# EAGLE design BPW5044-MIDIAUD-Wing (EAGLE 5.11)
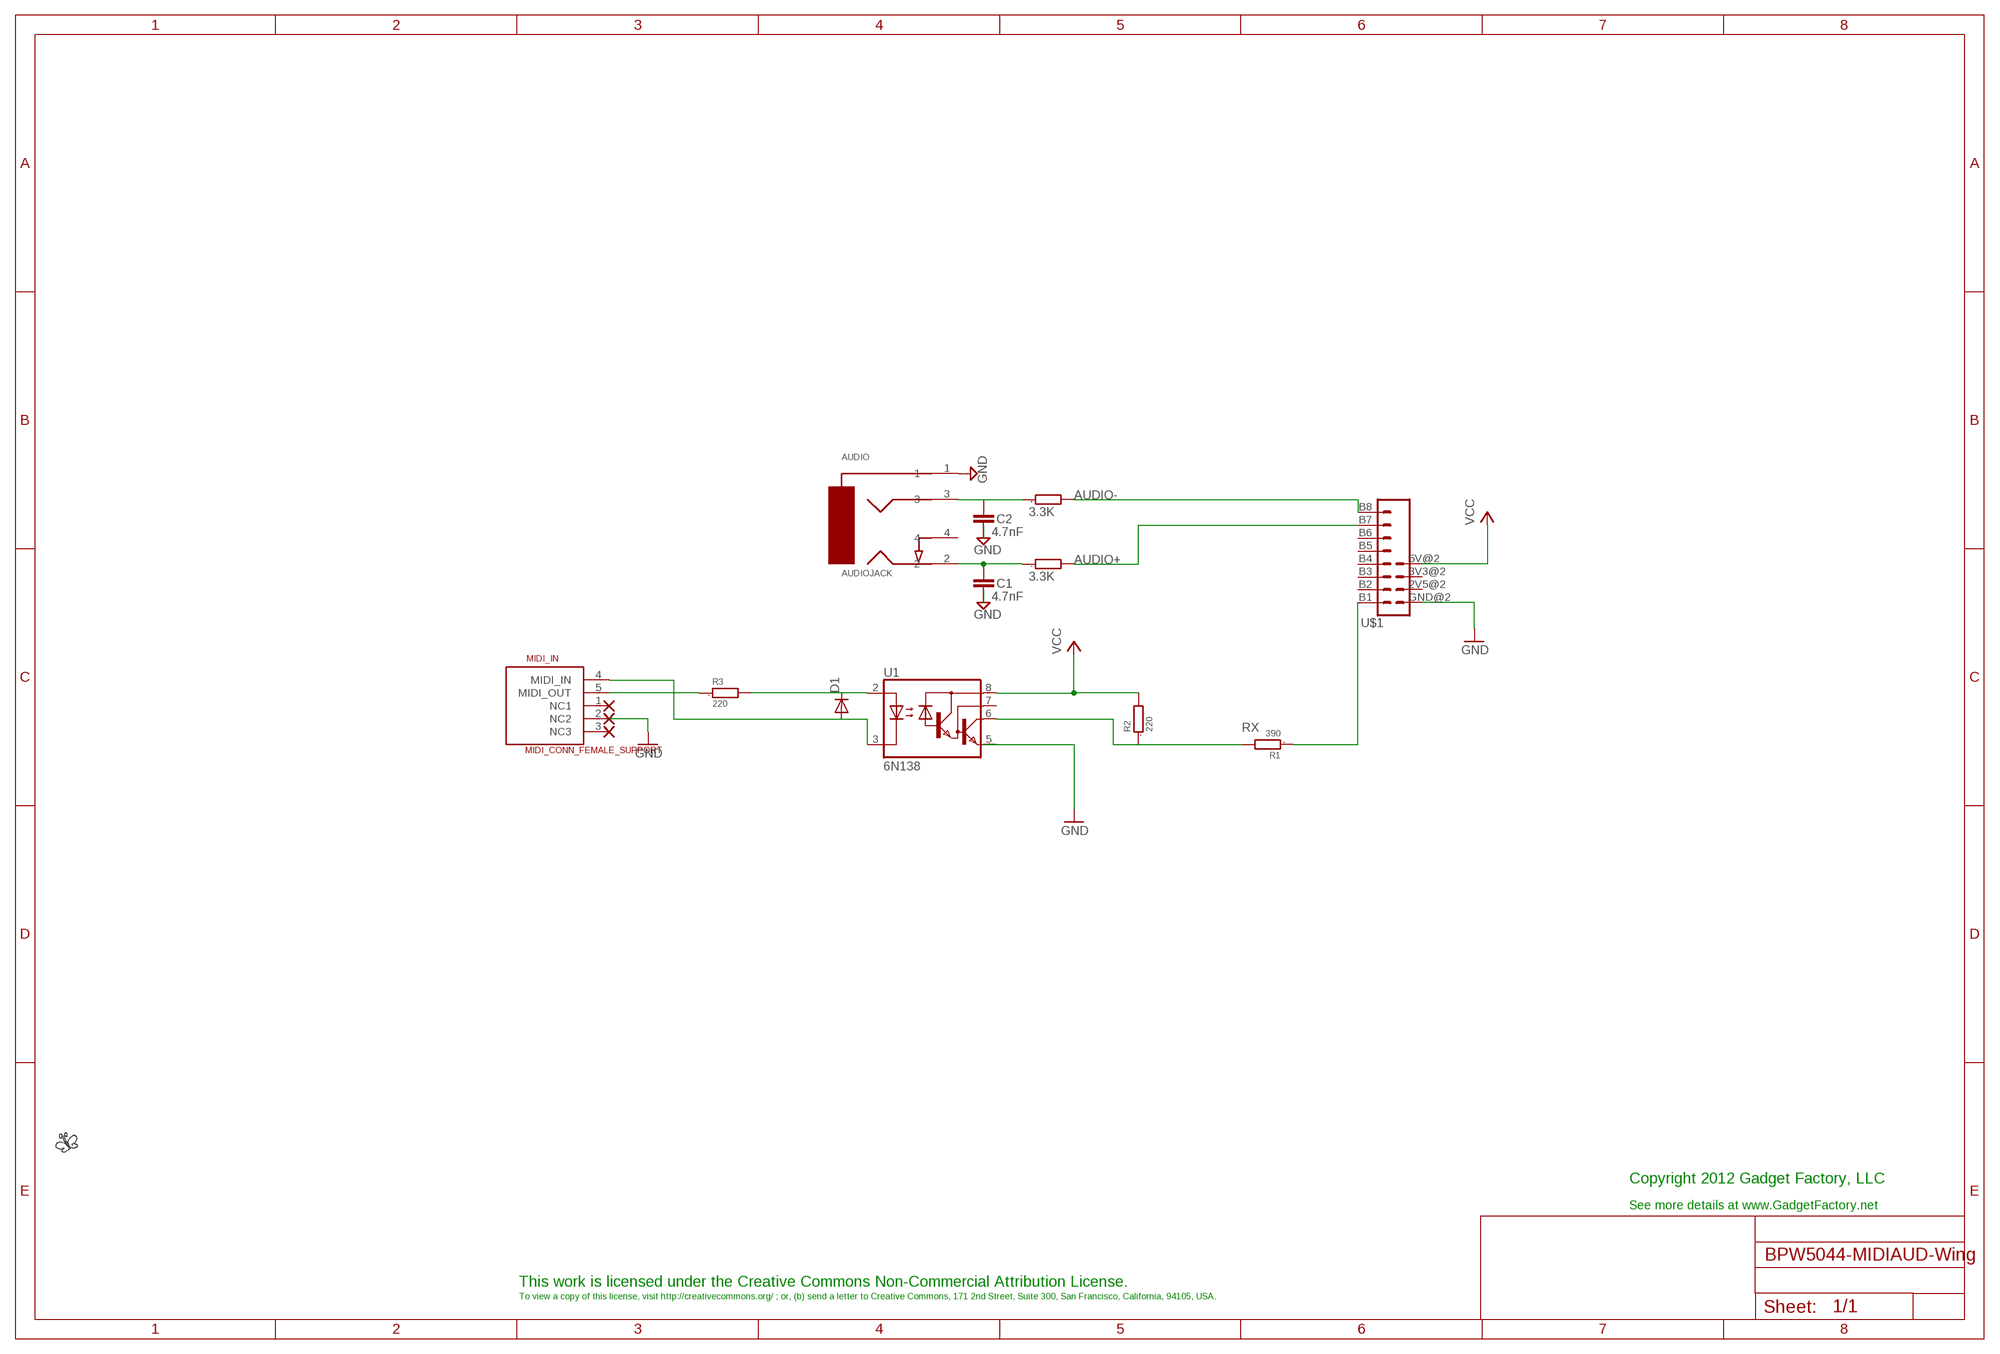
[diagram p0: schematic, sheet 1]

## Parts
AUDIO  AUDIOJACK  [AUDJCK]
C1  4.7nF  C-EU050-025X075  [C050-025X075]
C2  4.7nF  C-EU050-025X075  [C050-025X075]
D1  DIODE1N4148  [DIODE-1N4148]
LOGO1  BUTTERFLY_LOGO  [BUTTERFLY_LOGO]
MIDI_IN  MIDI_CONN_FEMALE_SUPPORT  [DIN_5_FEMALE_SUPPORT]
R1  390  R  [DUALRESISTOR]
R2  220  R  [DUALRESISTOR]
R3  220  R  [DUALRESISTOR]
R4  3.3K  R  [DUALRESISTOR]
R5  3.3K  R  [DUALRESISTOR]
U1  6N138  [DIL08]
U$1  WING_8BIT  [WINGSIDE_8BIT]

## Nets
AUDIO+: R4.2 U$1.B7
AUDIO-: R5.2 U$1.B8
GND: AUDIO.1 C1.2 C2.2 MIDI_IN.2(NC2) U1.5(GND) U$1.GND@2(GND)
N$1: AUDIO.3 C2.1 R5.1
N$2: D1.A MIDI_IN.4(MIDI_IN) U1.3(C)
N$3: D1.C R3.2 U1.2(A)
N$4: MIDI_IN.5(MIDI_OUT) R3.1
N$5: AUDIO.2 C1.1 R4.1
N$6: R1.1 U$1.B1
RX: R1.2 R2.1 U1.6(VO)
VCC: R2.2 U1.8(VCC) U$1.5V@2(5V)
Unconnected: AUDIO.4 MIDI_IN.1(NC1) MIDI_IN.3(NC3) U1.7(VB) U$1.2V5@2(2V5) U$1.3V3@2(3V3) U$1.B2 U$1.B3 U$1.B4 U$1.B5 U$1.B6

## Notes on the sheet
- Copyright 2012 Gadget Factory, LLC
- See more details at www.GadgetFactory.net
- This work is licensed under the Creative Commons Non-Commercial Attribution License.
- To view a copy of this license, visit http://creativecommons.org/ ; or, (b) send a letter to Creative Commons, 171 2nd Street, Suite 300, San Francisco, California, 94105, USA.

## Library data of the parts
AUDIO = GadgetFactory:AUDIOJACK
C1 C2 = resistor:C-EU: CAPACITOR, European symbol
D1 = SparkFun:DIODE: Diode These are standard reverse protection diodes and small signal diodes. SMA package can handle up to about 1A. SOD-323 can handle about 200mA. What the SOD-323 package when ordering, there are some mfgs out there that are 5-pin packages.
LOGO1 = GadgetFactory_Pub:BUTTERFLY_LOGO
MIDI_IN = GadgetFactory:MIDI_CONN_FEMALE_SUPPORT
R1-R5 = GadgetFactory:R: RESISTOR, European symbol
U1 = optocoupler:6N138: MOTOROLA OPTO COUPLER; MF: VISHAY/TELEFUNKEN; MPN: 6N138; OC_FARNELL: 9860150; OC_NEWARK: 35K5294
U$1 = GadgetFactory_Pub:WING_8BIT

## Board
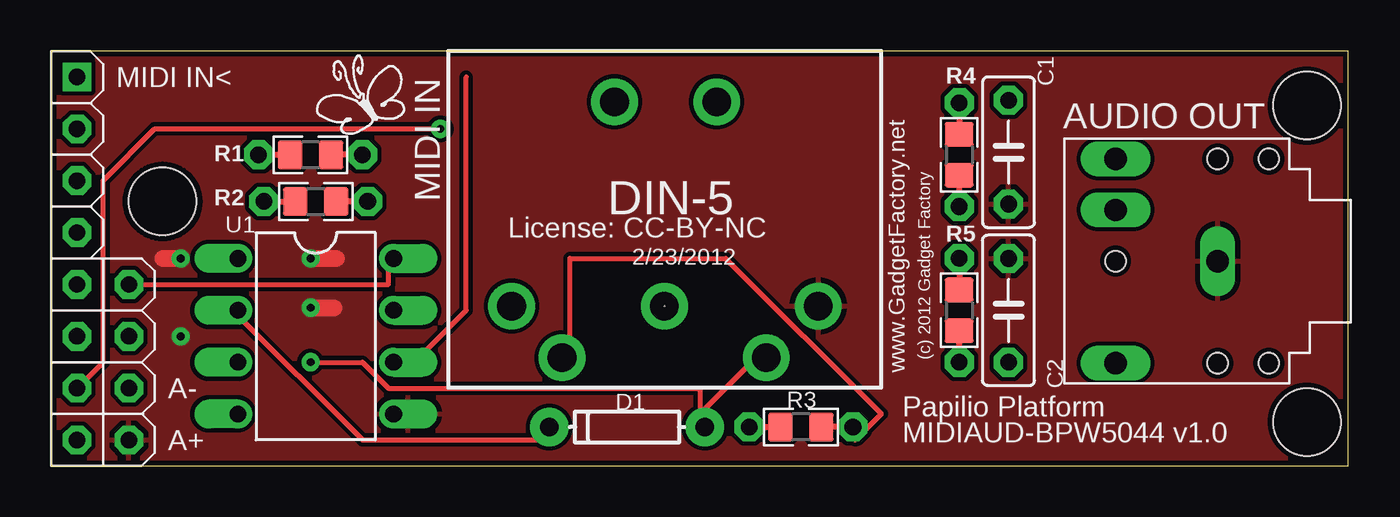
[diagram p1: board, top side]
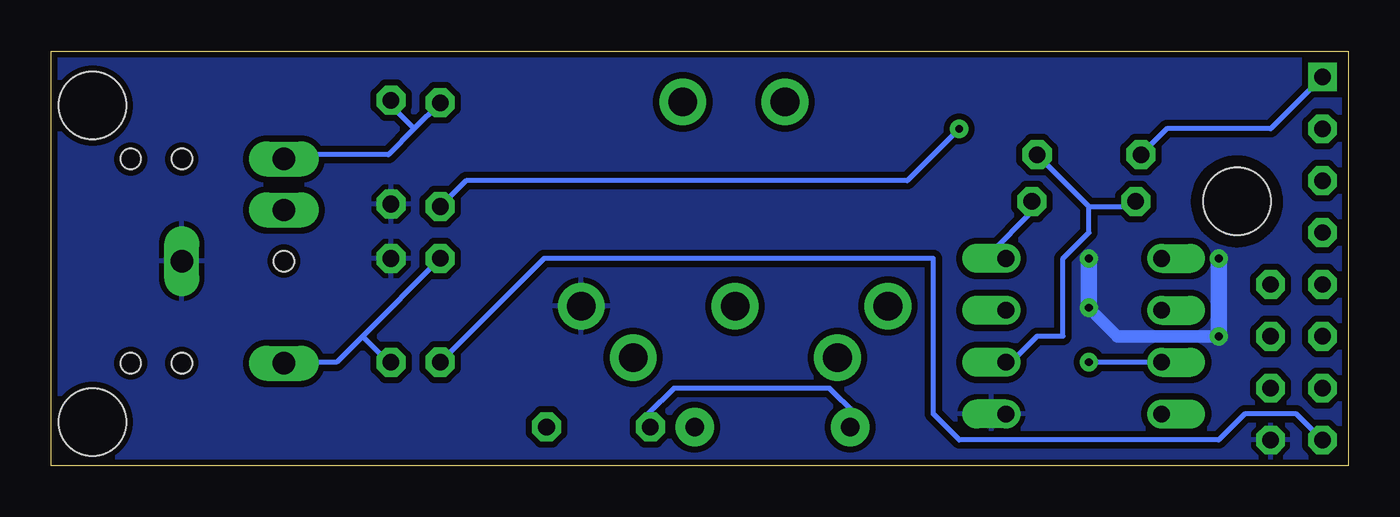
[diagram p2: board, bottom side, seen from below]

Size 63.5 x 20.32 mm. Coordinates in mm from the lower left corner, seen from the top.
Outline: 0,0 63.5,0 63.5,20.32 0,20.31 0,0
Copper layers (1*16): Top 0.035mm / dielectric 1.5mm / Bottom 0.035mm
Design rules "SparkFun_Derived_GoldePheonix_10mil": minimum track width 10mil, minimum drill 15mil, track to track 8mil, track to pad 8mil, pad to pad 8mil, via to via 8mil, smd to smd 8mil, copper to edge 10mil, drill to drill 8mil, minimum pad ring 12mil, minimum via ring 10mil, stop-mask expansion 4mil, vias tented up to drill 18mil, thermal gap 10mil
Holes 3.3 mm at 61.47,2.16 61.47,17.65

### Footprints (pad centres in the part's own frame; a part is rotated, then mirrored left to right if it is on the bottom)
AUDJCK = drill 1.1 long: 1 -5,0; 2 -10,5; 3 -10,-5; 4 -10,2.5 | hole 1: -5,5; -5,-5; -2.5,5; -2.5,-5; -10,0
C050-025X075 = drill 0.813 octagon: 1 -2.54,0; 2 2.54,0
DIODE-1N4148 = drill 0.9 pad 1.88 round: A -3.81,0; C 3.81,0
DIN_5_FEMALE_SUPPORT = drill 1.4 pad 2.286 round: 1 0.46,3.61; 2 -7.07,3.6; 3 7.94,3.6; 4 -4.53,6.12; 5 5.47,6.13; 6 -2.1,-6.4; 7 2.9,-6.4
DUALRESISTOR = drill 0.813 octagon: 1 -2.543,0; 2 2.537,0 | smd 1.2 x 1.4: 3 -1,0; 4 1,0
DIL08 = drill 0.813 offset: 1 -3.81,-3.81; 2 -1.27,-3.81; 3 1.27,-3.81; 4 3.81,-3.81; 5 3.81,3.81; 6 1.27,3.81; 7 -1.27,3.81; 8 -3.81,3.81
WINGSIDE_8BIT = drill 0.8 octagon: 2V5@2 16.51,3.81; 3V3@2 13.97,3.81; 5V@2 11.43,3.81; B2 3.81,1.27; B3 6.35,1.27; B4 8.89,1.27; B5 11.43,1.27; B6 13.97,1.27; B7 16.51,1.27; B8 19.05,1.27; GND@2 19.05,3.81 | drill 0.8 square: B1 1.27,1.27 | hole 3.302: 7.366,5.461

### Placement (x,y rotation side)
AUDIO  62.1,10.03 0 top
C1  46.86,15.37 270 top
C2  46.86,7.62 90 top
D1  28.19,1.91 180 top
LOGO1  15.24,17.65 0 top
MIDI_IN  30.48,11.43 180 top
R1  12.7,15.24 0 top
R2  12.95,12.95 0 top
R3  36.7,1.91 180 top
R4  44.45,15.24 270 top
R5  44.45,7.62 270 top
U1  12.95,6.35 270 top
U$1  0,20.32 270 top

### Tracks (layer width: path | path; a pad name or v marks a point on that pad's centre or on a via)
AUDIO+  (via drill 0.38)
  Top 0.254: U$1.B7 2.54,5.08 2.54,13.97 5.08,16.51 v19.05,16.51
  Bottom 0.254: v19.05,16.51 21.59,13.97 43.18,13.97 R4.2
AUDIO-
  Bottom 0.254: U$1.B8 2.54,2.54 5.08,2.54 6.35,1.27 19.05,1.27 20.32,2.54 20.32,10.16 39.37,10.16 R5.2
GND  (via drill 0.38)
  Top 0.813: v6.35,10.16 5.46,10.16 | v12.7,7.75 13.84,7.75 | v12.7,10.16 13.97,10.16
  Bottom 0.61: v6.35,6.35 11.3,6.35 v12.7,7.75
  Bottom 0.813: v6.35,6.35 v6.35,10.16 | v12.7,7.75 v12.7,10.16
  pour Bottom (isolate 0.305): 0,20.32 63.5,20.32 63.5,0 0,0
  pour Top: 0,20.32 63.5,20.32 63.5,0 0,0
N$1
  Bottom 0.254: 48.26,6.35 49.53,5.08 50.8,5.08 AUDIO.3 | 48.26,6.35 R5.1 | 48.26,6.35 46.99,5.08 C2.1
N$2  (via drill 0.38)
  Top 0.254: v12.7,5.08 15.24,5.08 16.51,3.81 31.75,3.81 31.75,2.54 | 31.75,2.54 34.29,5.08 MIDI_IN.4 | 31.75,2.54 D1.A
  Bottom 0.254: v12.7,5.08 U1.3 8.89,5.08
N$3
  Top 0.254: U1.2 8.89,7.62 15.24,1.27 24.13,1.27 D1.C
  Bottom 0.254: R3.2 34.29,2.54 33.02,3.81 25.4,3.81 24.13,2.54 D1.C
N$4
  Top 0.254: R3.1 39.37,1.27 40.64,2.54 33.02,10.16 25.4,10.16 25.4,6.35 MIDI_IN.5
N$5
  Bottom 0.254: 45.72,16.51 46.99,15.24 50.8,15.24 AUDIO.2 | 45.72,16.51 R4.1 | 45.72,16.51 46.99,17.78 C1.1
N$6
  Bottom 0.254: U$1.B1 3.81,16.51 8.89,16.51 R1.1
RX
  Top 0.254: 20.32,19.05 20.32,7.62 17.78,5.08 U1.6
  Bottom 0.254: 12.7,12.7 10.16,12.7 R2.1 | 12.7,12.7 R1.2 | 12.7,12.7 12.7,11.43 13.97,10.16 13.97,6.35 15.24,6.35 16.51,5.08 U1.6
VCC
  Top 0.254: U$1.5V@2 16.51,8.89 16.51,10.16 U1.8
  Bottom 0.254: R2.2 15.24,12.7 17.78,10.16 U1.8

### Text on the board
tPlace: MIDI IN< | AUDIO OUT | MIDI IN | License: CC-BY-NC | 2/23/2012 | www.GadgetFactory.net | (c) 2012 Gadget Factory | A- | Papilio Platform | A+ | MIDIAUD-BPW5044 v1.0